# Altium project Detection_Circuit.PrjPcb
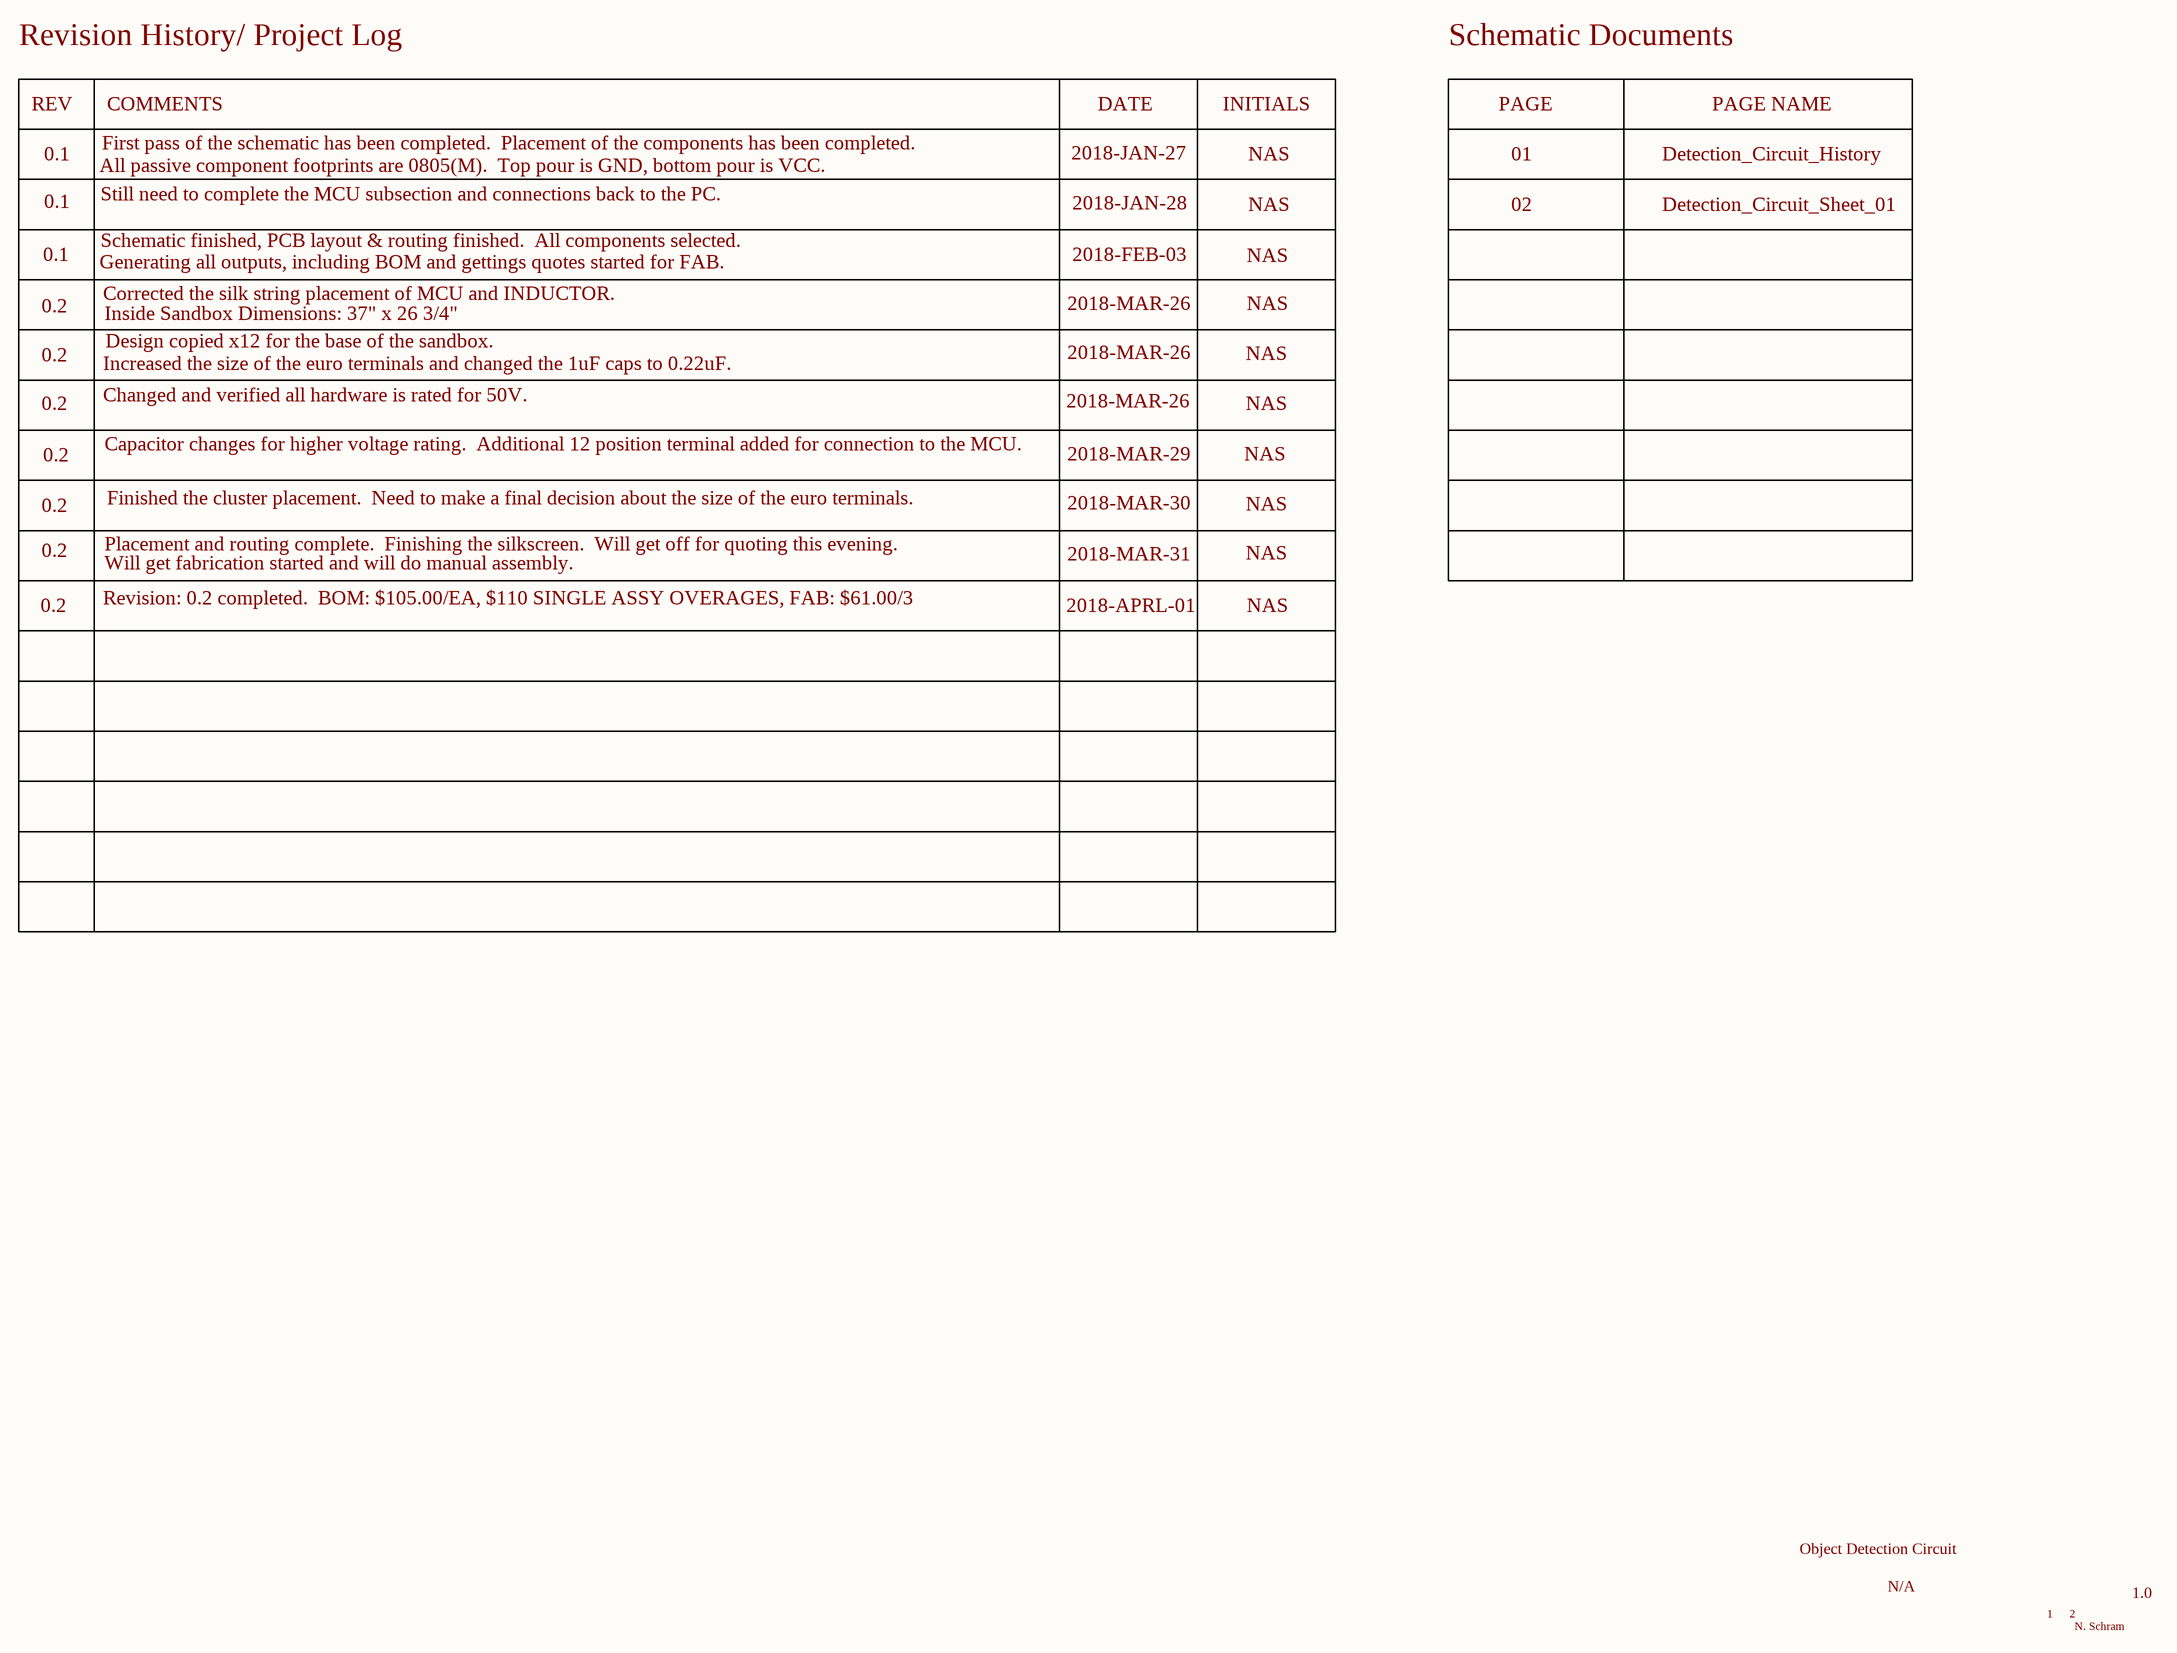
[diagram p0: Detection_Circuit_History.SchDoc]
2 sheets, 146 parts. Net scope: global (net labels, ports and power ports of the same name join across sheets).
Board file: Detection_Circuit_PCB.PcbDoc
Sheets:
  Detection_Circuit_History.SchDoc
  Detection_Circuit_Sheet_02.SchDoc

## Sheet Detection_Circuit_History.SchDoc: Object Detection PCB
size C; Date: 2018-FEB-03; Author: Nathan Schram; DrawnBy: Nathan Schram; Engineer: Nathan Schram; Revision: 1.0; SheetNumber: 1; SheetTotal: 2; DocumentName: Object Detection PCB; ProjectName: Augmented Reality Project

### Notes on the sheet
- Revision History/ Project Log
- Schematic Documents
- REV
- COMMENTS
- DATE
- INITIALS
- PAGE
- PAGE NAME
- 0.1
- All passive component footprints are 0805(M).  Top pour is GND, bottom pour is VCC.
- First pass of the schematic has been completed.  Placement of the components has been completed.
- 2018-JAN-27
- NAS
- 01
- Detection_Circuit_History
- Still need to complete the MCU subsection and connections back to the PC.
- Schematic finished, PCB layout & routing finished.  All components selected.
- 2018-JAN-28
- 02
- Detection_Circuit_Sheet_01
- 0.2
- Generating all outputs, including BOM and gettings quotes started for FAB.
- Corrected the silk string placement of MCU and INDUCTOR.
- 2018-MAR-26
- 2018-FEB-03
- Increased the size of the euro terminals and changed the 1uF caps to 0.22uF.
- Inside Sandbox Dimensions: 37" x 26 3/4"
- Design copied x12 for the base of the sandbox.
- Changed and verified all hardware is rated for 50V.
- Capacitor changes for higher voltage rating.  Additional 12 position terminal added for connection to the MCU.
- Finished the cluster placement.  Need to make a final decision about the size of the euro terminals.
- 2018-MAR-29
- Placement and routing complete.  Finishing the silkscreen.  Will get off for quoting this evening.
- 2018-MAR-30
- 2018-MAR-31
- Revision: 0.2 completed.  BOM: $105.00/EA, $110 SINGLE ASSY OVERAGES, FAB: $61.00/3
- Will get fabrication started and will do manual assembly.
- 2018-APRL-01
- Object Detection Circuit
- N/A
- 1
- 2
- N. Schram
- 1.0

## Sheet Detection_Circuit_Sheet_02.SchDoc: Object Detection
size D; Date: 2018-MAR-26; Author: N. Schram; DrawnBy: N. Schram; Engineer: N. Schram; Revision: 0.2; SheetNumber: 3
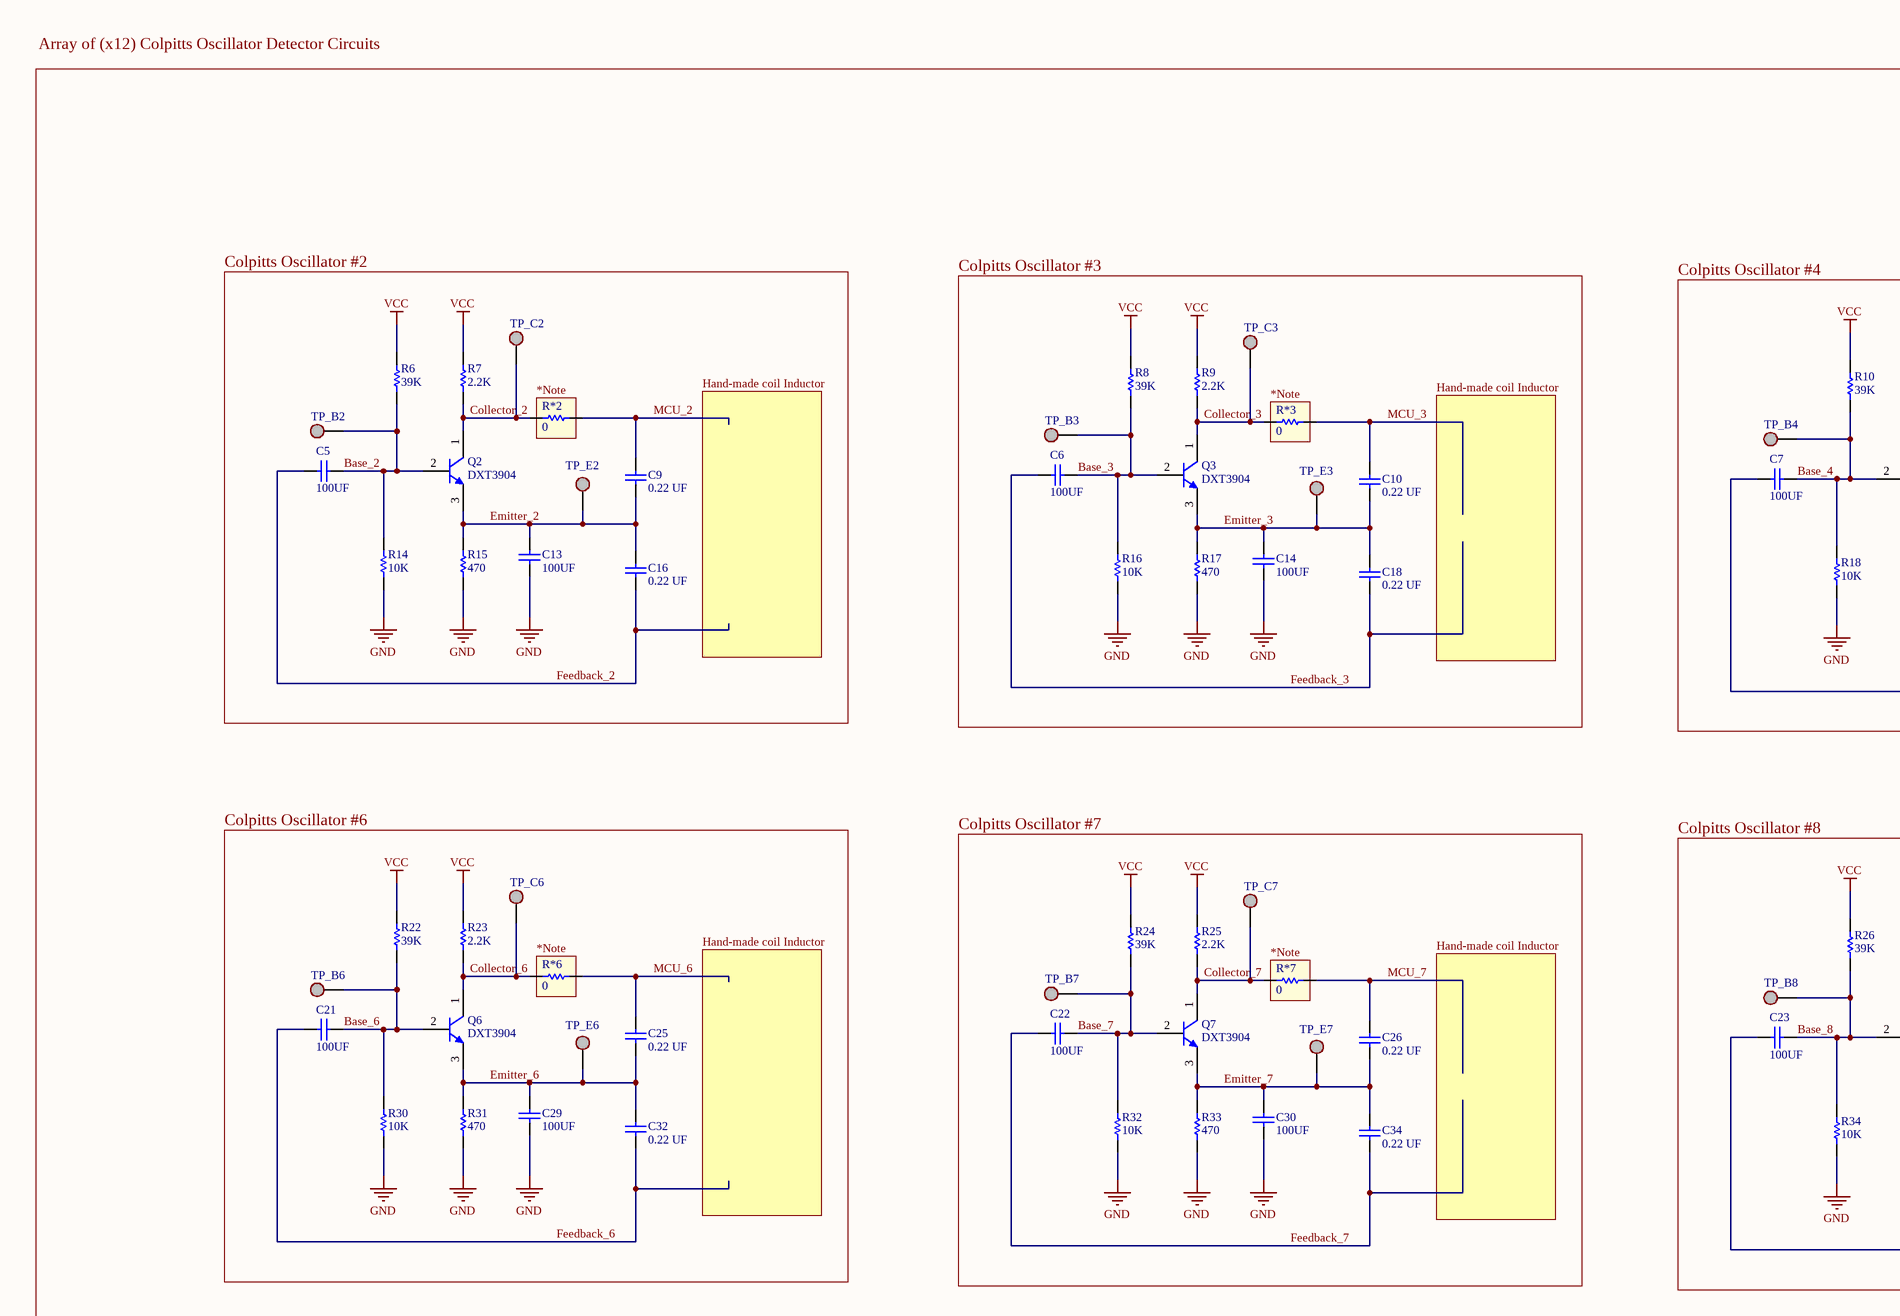
[diagram p1: Detection_Circuit_Sheet_02.SchDoc, top left]
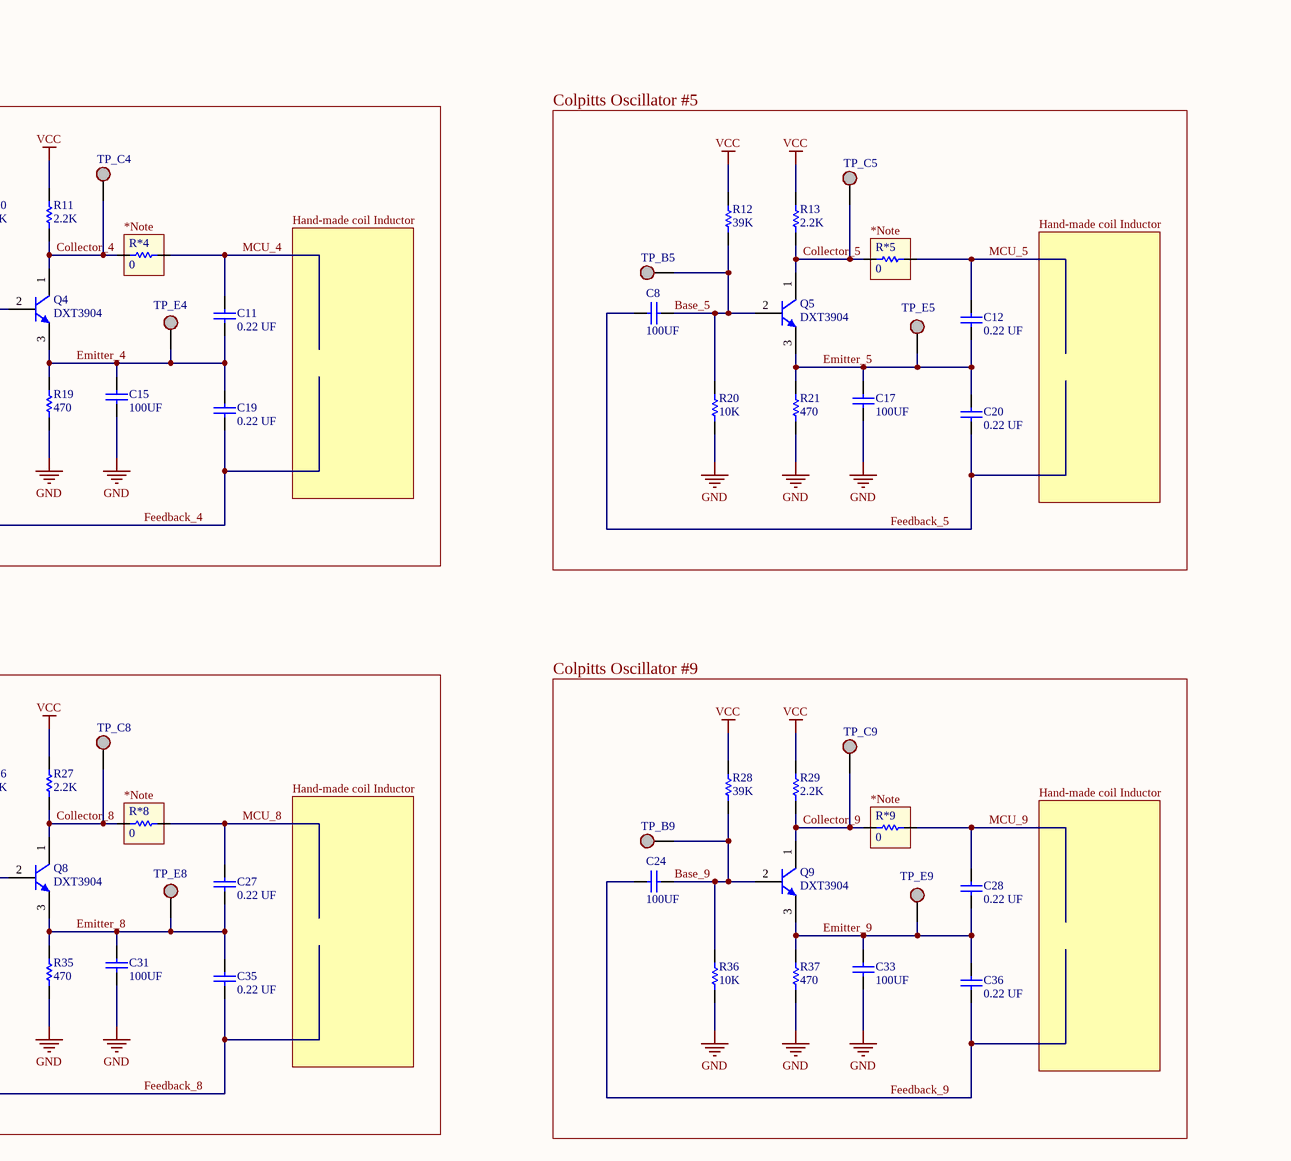
[diagram p2: Detection_Circuit_Sheet_02.SchDoc, top right]
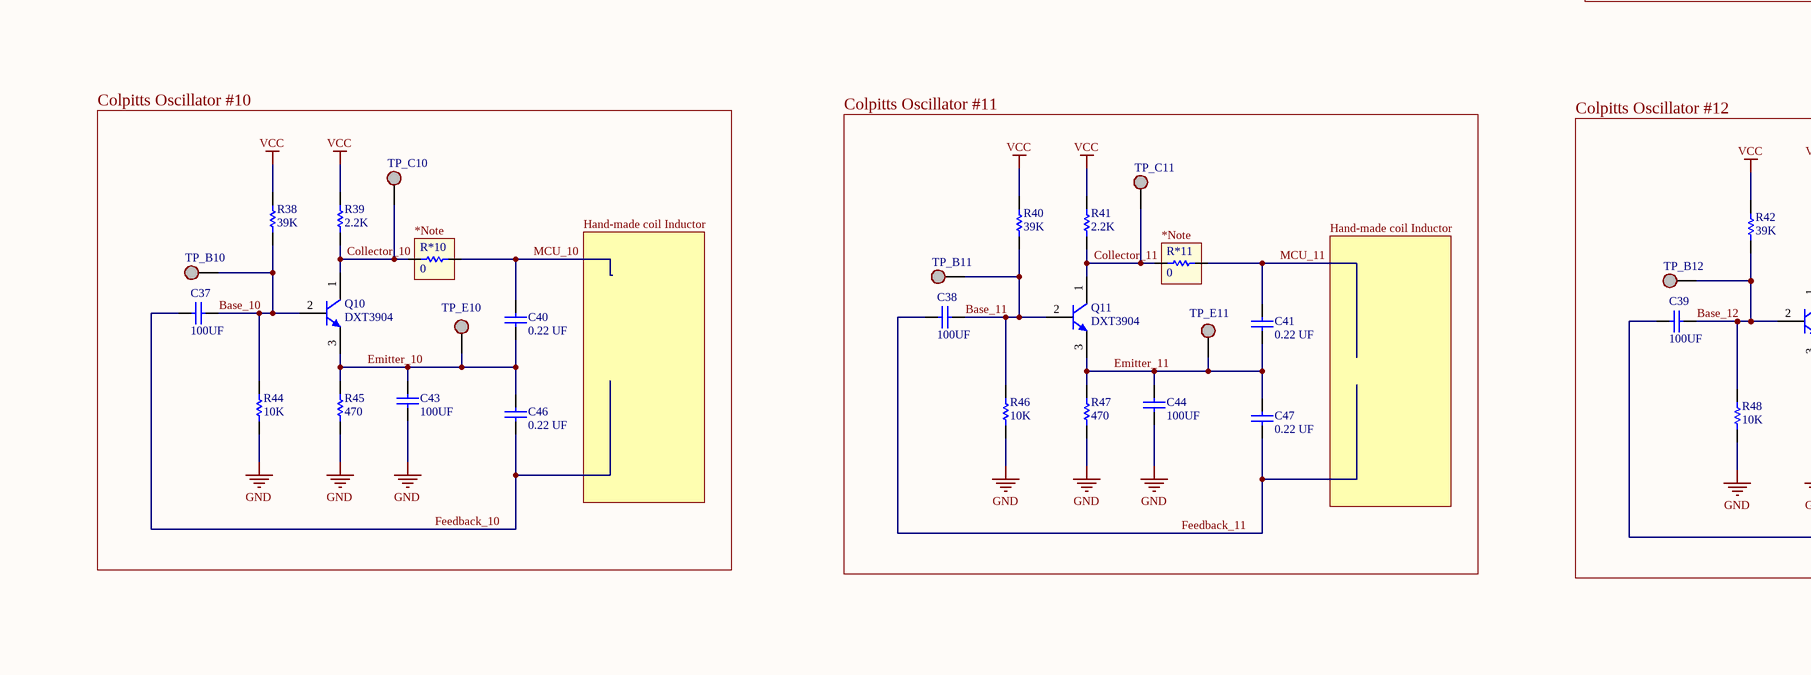
[diagram p3: Detection_Circuit_Sheet_02.SchDoc, bottom left]
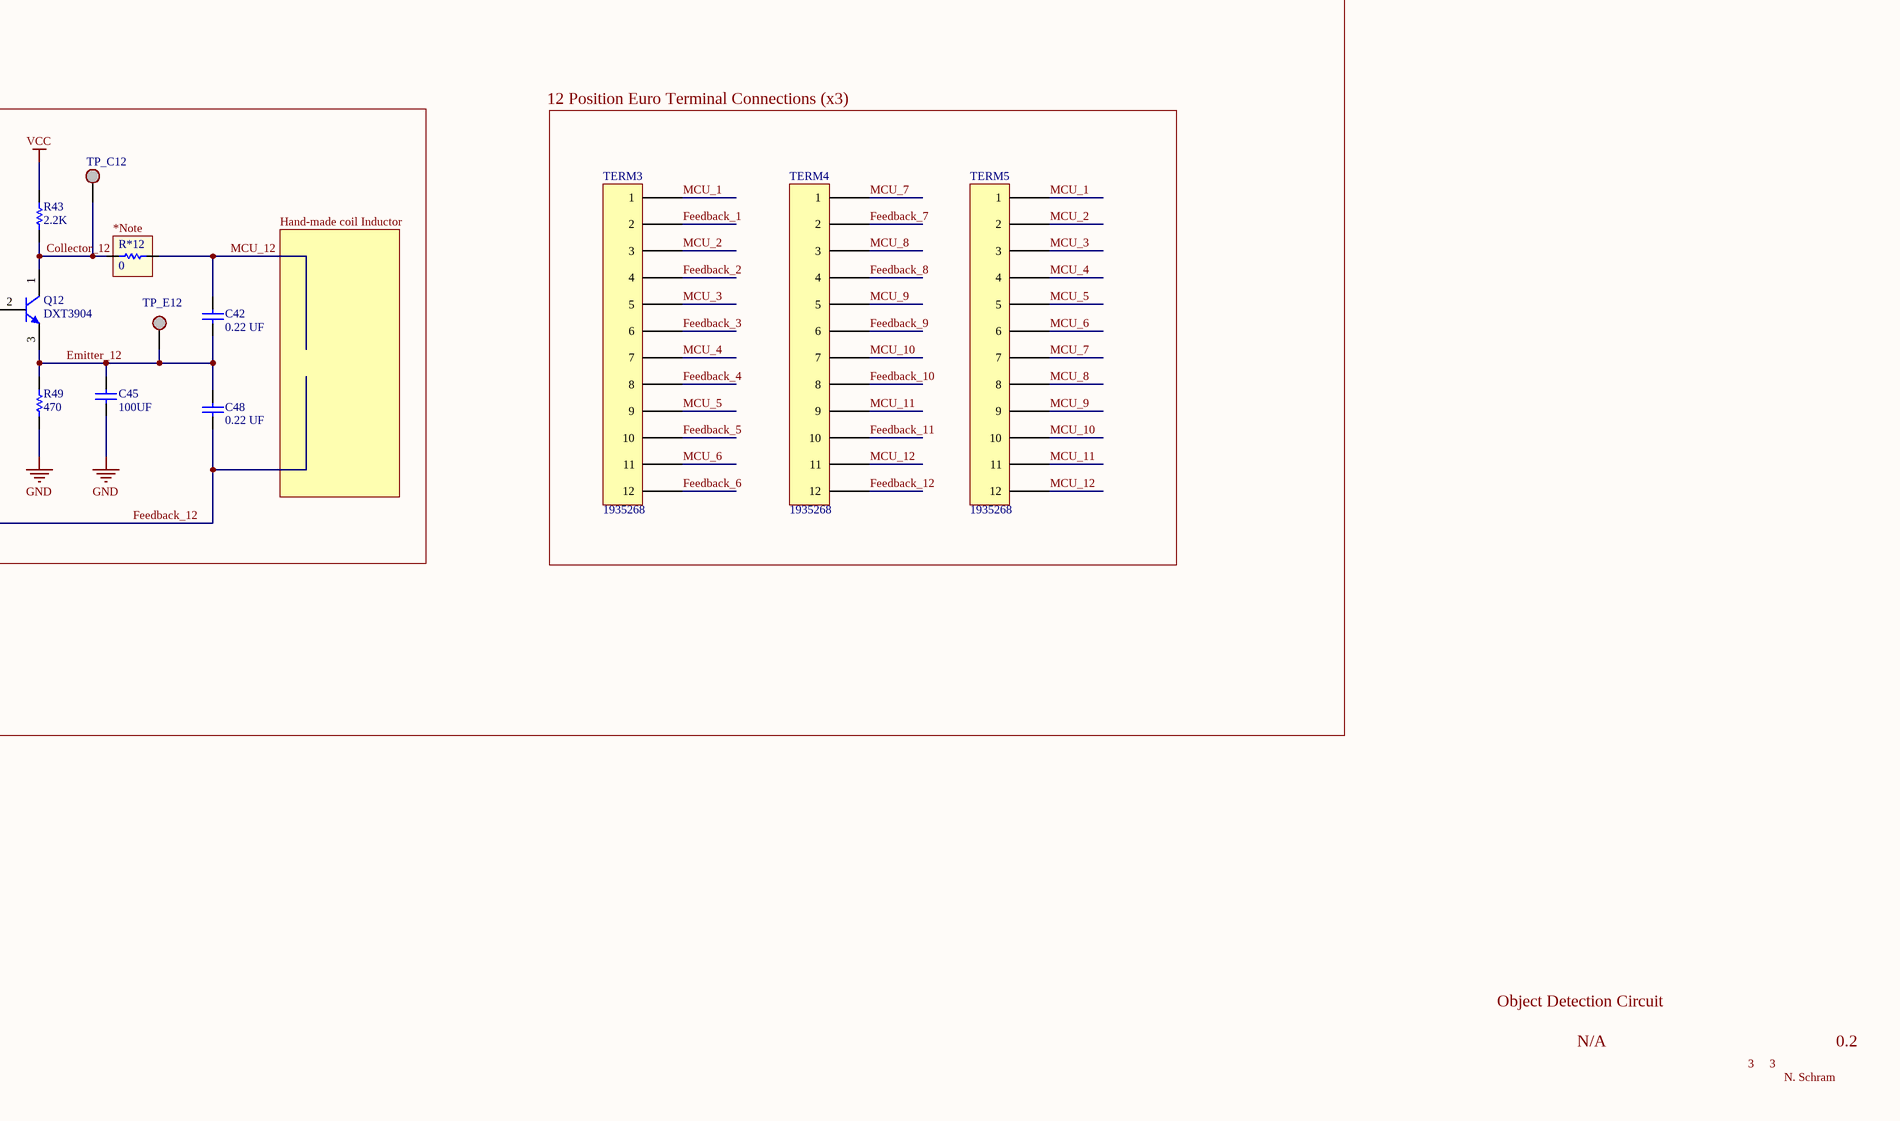
[diagram p4: Detection_Circuit_Sheet_02.SchDoc, bottom right]

### Parts
C5  100UF  [C1210_M]
C6  100UF  [C1210_M]
C7  100UF  [C1210_M]
C8  100UF  [C1210_M]
C9  Capacitance: 0.22 UF  [6-0805_N]  (hidden comment: 08055C224JAT2A)
C10  Capacitance: 0.22 UF  [6-0805_N]  (hidden comment: 08055C224JAT2A)
C11  Capacitance: 0.22 UF  [6-0805_N]  (hidden comment: 08055C224JAT2A)
C12  Capacitance: 0.22 UF  [6-0805_N]  (hidden comment: 08055C224JAT2A)
C13  100UF  [C1210_M]
C14  100UF  [C1210_M]
C15  100UF  [C1210_M]
C16  Capacitance: 0.22 UF  [6-0805_N]  (hidden comment: 08055C224JAT2A)
C17  100UF  [C1210_M]
C18  Capacitance: 0.22 UF  [6-0805_N]  (hidden comment: 08055C224JAT2A)
C19  Capacitance: 0.22 UF  [6-0805_N]  (hidden comment: 08055C224JAT2A)
C20  Capacitance: 0.22 UF  [6-0805_N]  (hidden comment: 08055C224JAT2A)
C21  100UF  [C1210_M]
C22  100UF  [C1210_M]
C23  100UF  [C1210_M]
C24  100UF  [C1210_M]
C25  Capacitance: 0.22 UF  [6-0805_N]  (hidden comment: 08055C224JAT2A)
C26  Capacitance: 0.22 UF  [6-0805_N]  (hidden comment: 08055C224JAT2A)
C27  Capacitance: 0.22 UF  [6-0805_N]  (hidden comment: 08055C224JAT2A)
C28  Capacitance: 0.22 UF  [6-0805_N]  (hidden comment: 08055C224JAT2A)
C29  100UF  [C1210_M]
C30  100UF  [C1210_M]
C31  100UF  [C1210_M]
C32  Capacitance: 0.22 UF  [6-0805_N]  (hidden comment: 08055C224JAT2A)
C33  100UF  [C1210_M]
C34  Capacitance: 0.22 UF  [6-0805_N]  (hidden comment: 08055C224JAT2A)
C35  Capacitance: 0.22 UF  [6-0805_N]  (hidden comment: 08055C224JAT2A)
C36  Capacitance: 0.22 UF  [6-0805_N]  (hidden comment: 08055C224JAT2A)
C37  100UF  [C1210_M]
C38  100UF  [C1210_M]
C39  100UF  [C1210_M]
C40  Capacitance: 0.22 UF  [6-0805_N]  (hidden comment: 08055C224JAT2A)
C41  Capacitance: 0.22 UF  [6-0805_N]  (hidden comment: 08055C224JAT2A)
C42  Capacitance: 0.22 UF  [6-0805_N]  (hidden comment: 08055C224JAT2A)
C43  100UF  [C1210_M]
C44  100UF  [C1210_M]
C45  100UF  [C1210_M]
C46  Capacitance: 0.22 UF  [6-0805_N]  (hidden comment: 08055C224JAT2A)
C47  Capacitance: 0.22 UF  [6-0805_N]  (hidden comment: 08055C224JAT2A)
C48  Capacitance: 0.22 UF  [6-0805_N]  (hidden comment: 08055C224JAT2A)
Q2  DXT3904  [DXT3904-13]
Q3  DXT3904  [DXT3904-13]
Q4  DXT3904  [DXT3904-13]
Q5  DXT3904  [DXT3904-13]
Q6  DXT3904  [DXT3904-13]
Q7  DXT3904  [DXT3904-13]
Q8  DXT3904  [DXT3904-13]
Q9  DXT3904  [DXT3904-13]
Q10  DXT3904  [DXT3904-13]
Q11  DXT3904  [DXT3904-13]
Q12  DXT3904  [DXT3904-13]
R6  39K  [6-0805_M]
R7  2.2K  [6-0805_M]
R8  39K  [6-0805_M]
R9  2.2K  [6-0805_M]
R10  39K  [6-0805_M]
R11  2.2K  [6-0805_M]
R12  39K  [6-0805_M]
R13  2.2K  [6-0805_M]
R14  10K  [6-0805_M]
R15  470  [6-0805_M]
R16  10K  [6-0805_M]
R17  470  [6-0805_M]
R18  10K  [6-0805_M]
R19  470  [6-0805_M]
R20  10K  [6-0805_M]
R21  470  [6-0805_M]
R22  39K  [6-0805_M]
R23  2.2K  [6-0805_M]
R24  39K  [6-0805_M]
R25  2.2K  [6-0805_M]
R26  39K  [6-0805_M]
R27  2.2K  [6-0805_M]
R28  39K  [6-0805_M]
R29  2.2K  [6-0805_M]
R30  10K  [6-0805_M]
R31  470  [6-0805_M]
R32  10K  [6-0805_M]
R33  470  [6-0805_M]
R34  10K  [6-0805_M]
R35  470  [6-0805_M]
R36  10K  [6-0805_M]
R37  470  [6-0805_M]
R38  39K  [6-0805_M]
R39  2.2K  [6-0805_M]
R40  39K  [6-0805_M]
R41  2.2K  [6-0805_M]
R42  39K  [6-0805_M]
R43  2.2K  [6-0805_M]
R44  10K  [6-0805_M]
R45  470  [6-0805_M]
R46  10K  [6-0805_M]
R47  470  [6-0805_M]
R48  10K  [6-0805_M]
R49  470  [6-0805_M]
R*2  0  [6-0805_M]
R*3  0  [6-0805_M]
R*4  0  [6-0805_M]
R*5  0  [6-0805_M]
R*6  0  [6-0805_M]
R*7  0  [6-0805_M]
R*8  0  [6-0805_M]
R*9  0  [6-0805_M]
R*10  0  [6-0805_M]
R*11  0  [6-0805_M]
R*12  0  [6-0805_M]
TERM3  1935268  [1935268]
TERM4  1935268  [1935268]
TERM5  1935268  [1935268]
TP_B2  TestPoint  [TestPoint]  (value not drawn)
TP_B3  TestPoint  [TestPoint]  (value not drawn)
TP_B4  TestPoint  [TestPoint]  (value not drawn)
TP_B5  TestPoint  [TestPoint]  (value not drawn)
TP_B6  TestPoint  [TestPoint]  (value not drawn)
TP_B7  TestPoint  [TestPoint]  (value not drawn)
TP_B8  TestPoint  [TestPoint]  (value not drawn)
TP_B9  TestPoint  [TestPoint]  (value not drawn)
TP_B10  TestPoint  [TestPoint]  (value not drawn)
TP_B11  TestPoint  [TestPoint]  (value not drawn)
TP_B12  TestPoint  [TestPoint]  (value not drawn)
TP_C2  TestPoint  [TestPoint]  (value not drawn)
TP_C3  TestPoint  [TestPoint]  (value not drawn)
TP_C4  TestPoint  [TestPoint]  (value not drawn)
TP_C5  TestPoint  [TestPoint]  (value not drawn)
TP_C6  TestPoint  [TestPoint]  (value not drawn)
TP_C7  TestPoint  [TestPoint]  (value not drawn)
TP_C8  TestPoint  [TestPoint]  (value not drawn)
TP_C9  TestPoint  [TestPoint]  (value not drawn)
TP_C10  TestPoint  [TestPoint]  (value not drawn)
TP_C11  TestPoint  [TestPoint]  (value not drawn)
TP_C12  TestPoint  [TestPoint]  (value not drawn)
TP_E2  TestPoint  [TestPoint]  (value not drawn)
TP_E3  TestPoint  [TestPoint]  (value not drawn)
TP_E4  TestPoint  [TestPoint]  (value not drawn)
TP_E5  TestPoint  [TestPoint]  (value not drawn)
TP_E6  TestPoint  [TestPoint]  (value not drawn)
TP_E7  TestPoint  [TestPoint]  (value not drawn)
TP_E8  TestPoint  [TestPoint]  (value not drawn)
TP_E9  TestPoint  [TestPoint]  (value not drawn)
TP_E10  TestPoint  [TestPoint]  (value not drawn)
TP_E11  TestPoint  [TestPoint]  (value not drawn)
TP_E12  TestPoint  [TestPoint]  (value not drawn)

### Blocks framed on the sheet
Colpitts Oscillator #2: C5 C9 C13 C16 Q2 R6 R7 R14 R15 R*2 TP_B2 TP_C2 TP_E2
Colpitts Oscillator #3: C6 C10 C14 C18 Q3 R8 R9 R16 R17 R*3 TP_B3 TP_C3 TP_E3
Colpitts Oscillator #4: C7 C11 C15 C19 Q4 R10 R11 R18 R19 R*4 TP_B4 TP_C4 TP_E4
Colpitts Oscillator #5: C8 C12 C17 C20 Q5 R12 R13 R20 R21 R*5 TP_B5 TP_C5 TP_E5
Colpitts Oscillator #6: C21 C25 C29 C32 Q6 R22 R23 R30 R31 R*6 TP_B6 TP_C6 TP_E6
Colpitts Oscillator #7: C22 C26 C30 C34 Q7 R24 R25 R32 R33 R*7 TP_B7 TP_C7 TP_E7
Colpitts Oscillator #8: C23 C27 C31 C35 Q8 R26 R27 R34 R35 R*8 TP_B8 TP_C8 TP_E8
Colpitts Oscillator #9: C24 C28 C33 C36 Q9 R28 R29 R36 R37 R*9 TP_B9 TP_C9 TP_E9
Colpitts Oscillator #10: C37 C40 C43 C46 Q10 R38 R39 R44 R45 R*10 TP_B10 TP_C10 TP_E10
Colpitts Oscillator #11: C38 C41 C44 C47 Q11 R40 R41 R46 R47 R*11 TP_B11 TP_C11 TP_E11
Colpitts Oscillator #12: C39 C42 C45 C48 Q12 R42 R43 R48 R49 R*12 TP_B12 TP_C12 TP_E12
12 Position Euro Terminal Connections (x3): TERM3-TERM5

### Nets
GND: C13.1 C14.1 C15.1 C17.1 C29.1 C30.1 C31.1 C33.1 C43.1 C44.1 C45.1 R14.1 R15.1 R16.1 R17.1 R18.1 R19.1 R20.1 R21.1 R30.1 R31.1 R32.1 R33.1 R34.1 R35.1 R36.1 R37.1 R44.1 R45.1 R46.1 R47.1 R48.1 R49.1
VCC: R6.2 R7.2 R8.2 R9.2 R10.2 R11.2 R12.2 R13.2 R22.2 R23.2 R24.2 R25.2 R26.2 R27.2 R28.2 R29.2 R38.2 R39.2 R40.2 R41.2 R42.2 R43.2
Base_2: C5.2 Q2.2(B) R6.1 R14.2 TP_B2.1
Base_3: C6.2 Q3.2(B) R8.1 R16.2 TP_B3.1
Base_4: C7.2 Q4.2(B) R10.1 R18.2 TP_B4.1
Base_5: C8.2 Q5.2(B) R12.1 R20.2 TP_B5.1
Base_6: C21.2 Q6.2(B) R22.1 R30.2 TP_B6.1
Base_7: C22.2 Q7.2(B) R24.1 R32.2 TP_B7.1
Base_8: C23.2 Q8.2(B) R26.1 R34.2 TP_B8.1
Base_9: C24.2 Q9.2(B) R28.1 R36.2 TP_B9.1
Base_10: C37.2 Q10.2(B) R38.1 R44.2 TP_B10.1
Base_11: C38.2 Q11.2(B) R40.1 R46.2 TP_B11.1
Base_12: C39.2 Q12.2(B) R42.1 R48.2 TP_B12.1
Collector_2: Q2.1(C) R7.1 R*2.1 TP_C2.1
Collector_3: Q3.1(C) R9.1 R*3.1 TP_C3.1
Collector_4: Q4.1(C) R11.1 R*4.1 TP_C4.1
Collector_5: Q5.1(C) R13.1 R*5.1 TP_C5.1
Collector_6: Q6.1(C) R23.1 R*6.1 TP_C6.1
Collector_7: Q7.1(C) R25.1 R*7.1 TP_C7.1
Collector_8: Q8.1(C) R27.1 R*8.1 TP_C8.1
Collector_9: Q9.1(C) R29.1 R*9.1 TP_C9.1
Collector_10: Q10.1(C) R39.1 R*10.1 TP_C10.1
Collector_11: Q11.1(C) R41.1 R*11.1 TP_C11.1
Collector_12: Q12.1(C) R43.1 R*12.1 TP_C12.1
Emitter_2: C9.1 C13.2 C16.2 Q2.3(E) R15.2 TP_E2.1
Emitter_3: C10.1 C14.2 C18.2 Q3.3(E) R17.2 TP_E3.1
Emitter_4: C11.1 C15.2 C19.2 Q4.3(E) R19.2 TP_E4.1
Emitter_5: C12.1 C17.2 C20.2 Q5.3(E) R21.2 TP_E5.1
Emitter_6: C25.1 C29.2 C32.2 Q6.3(E) R31.2 TP_E6.1
Emitter_7: C26.1 C30.2 C34.2 Q7.3(E) R33.2 TP_E7.1
Emitter_8: C27.1 C31.2 C35.2 Q8.3(E) R35.2 TP_E8.1
Emitter_9: C28.1 C33.2 C36.2 Q9.3(E) R37.2 TP_E9.1
Emitter_10: C40.1 C43.2 C46.2 Q10.3(E) R45.2 TP_E10.1
Emitter_11: C41.1 C44.2 C47.2 Q11.3(E) R47.2 TP_E11.1
Emitter_12: C42.1 C45.2 C48.2 Q12.3(E) R49.2 TP_E12.1
Feedback_1: TERM3.2
Feedback_2: C5.1 C16.1 TERM3.4
Feedback_3: C6.1 C18.1 TERM3.6
Feedback_4: C7.1 C19.1 TERM3.8
Feedback_5: C8.1 C20.1 TERM3.10
Feedback_6: C21.1 C32.1 TERM3.12
Feedback_7: C22.1 C34.1 TERM4.2
Feedback_8: C23.1 C35.1 TERM4.4
Feedback_9: C24.1 C36.1 TERM4.6
Feedback_10: C37.1 C46.1 TERM4.8
Feedback_11: C38.1 C47.1 TERM4.10
Feedback_12: C39.1 C48.1 TERM4.12
MCU_1: TERM3.1 TERM5.1
MCU_2: C9.2 R*2.2 TERM3.3 TERM5.2
MCU_3: C10.2 R*3.2 TERM3.5 TERM5.3
MCU_4: C11.2 R*4.2 TERM3.7 TERM5.4
MCU_5: C12.2 R*5.2 TERM3.9 TERM5.5
MCU_6: C25.2 R*6.2 TERM3.11 TERM5.6
MCU_7: C26.2 R*7.2 TERM4.1 TERM5.7
MCU_8: C27.2 R*8.2 TERM4.3 TERM5.8
MCU_9: C28.2 R*9.2 TERM4.5 TERM5.9
MCU_10: C40.2 R*10.2 TERM4.7 TERM5.10
MCU_11: C41.2 R*11.2 TERM4.9 TERM5.11
MCU_12: C42.2 R*12.2 TERM4.11 TERM5.12

### Notes on the sheet
- Array of (x12) Colpitts Oscillator Detector Circuits
- (near R*2) *Note
- Hand-made coil Inductor
- (near R*3) *Note
- (near R*4) *Note
- (near R*5) *Note
- (near R*6) *Note
- (near R*7) *Note
- (near R*8) *Note
- (near R*9) *Note
- (near R*10) *Note
- (near R*11) *Note
- (near R*12) *Note
- Object Detection Circuit
- N/A
- 3
- N. Schram
- 0.2

### Library data of the parts
C5-C8 C13-C15 C17 C21-C24 C29-C31 C33 C37-C39 C43-C45 = CC1210MKX5R7BB107: CAP CER 100UF 16V X5R 1210; Manufacturer: Yageo; Capacitance: 100µF; Tolerance: ±20%; Supplier 1: Digi-Key; Manufacturer Part Number: CC1210MKX5R7BB107; Family: Ceramic Capacitors; Series: CC; Packaging: Tape & Reel (TR); Voltage - Rated: 16V; Temperature Coefficient: X5R; Mounting Type: Surface Mount, MLCC; Operating Temperature: -55°C ~ 85°C; Applications: General Purpose; Ratings: -; Package / Case: 1210 (3225 Metric); Size / Dimension: 0.126" L x 0.098" W (3.20mm x 2.50mm); Height - Seated (Max): -; Thickness (Max): 0.110" (2.80mm); Lead Spacing: -; Features: -; Lead Style: -; ComponentLink1URL: http://www.mouser.com/ds/2/447/Yageo_UPY-GP_NP0_16V-to-50V_9-358835.pdf; ComponentLink1Description: http://www.mouser.com/ds/2/447/Yageo_UPY-GP_NP0_16V-to-50V_9-358835.pdf; ComponentLink2URL: http://www.yageo.com/documents/recent/UPY-GPHC_X5R_4V-to-50V_25.pdf; ComponentLink2Description: http://www.yageo.com/documents/recent/UPY-GPHC_X5R_4V-to-50V_25.pdf; Supplier Part Number 1: 311-2052-1-ND; Stock 1: 19901; Pricing 1: 1=1.82, 10=1.437, 100=1.0778 (USD); Category: Capacitors
C9-C12 C16 C18-C20 C25-C28 C32 C34-C36 C40-C42 C46-C48 = 08055C224JAT2A: CAP CER 0.22UF 50V X7R 0805; Manufacturer: AVX Corporation; Tolerance: ±5%; Notification: Current market demand for these product types have resulted in fluctuating and extending lead times. Lead times may differ.; Supplier 1: Digi-Key; Manufacturer Part Number: 08055C224JAT2A; RoHS: RoHS Compliant; Category: Capacitors; Stock 1: 25172; Pricing 1: 1=0.55, 10=0.387, 100=0.255, 500=0.18886, 1000=0.16053 (USD); Packaging: Cut Tape (CT); Part Status: Active; Voltage - Rated: 50V; Temperature Coefficient: X7R; Operating Temperature: -55°C ~ 125°C; Features: -; Ratings: -; Applications: General Purpose; Mounting Type: Surface Mount, MLCC; Package / Case: 0805 (2012 Metric); Size / Dimension: 0.079" L x 0.049" W (2.00mm x 1.25mm); Height - Seated (Max): -; Thickness (Max): 0.037" (0.94mm); Lead Spacing: -; Lead Style: -; ComponentLink1URL: http://datasheets.avx.com/X7RDielectric.pdf; ComponentLink1Description: http://datasheets.avx.com/X7RDielectric.pdf; Supplier Part Number 1: 478-7437-1-ND
Q2-Q12 = DXT3904-13: TRANS NPN 40V 0.2A SOT89-3; Manufacturer: Diodes; Configuration: Single; Collector- Base Voltage VCBO: 60 V; Emitter- Base Voltage VEBO: 6 V; Collector-Emitter Saturation Voltage: 300 mV; Maximum DC Collector Current: 200 mA; Gain Bandwidth Product fT: 300 MHz; Brand: Diodes Incorporated; DC Collector/Base Gain hfe Min: 30 at 100 mA, 1 V; Pd - Power Dissipation: 1000 mW; Unit Weight: 0.001834 oz; Supplier 1: Digi-Key; Manufacturer Part Number: DXT3904-13; Product Category: Bipolar Transistors - BJT; Mounting Style: SMD/SMT; Package / Case: SOT-89; Transistor Polarity: NPN; Collector- Emitter Voltage VCEO Max: 40 V; Maximum Operating Temperature: + 150 C; Series: DXT3904; Height: 1.5 mm; Length: 4.5 mm; Minimum Operating Temperature: - 55 C; Packaging: Reel; Factory Pack Quantity: 2500; Width: 2.48 mm; ComponentLink1URL: https://datasheet.ciiva.com/979/ds31141-979988.pdf; ComponentLink1Description: https://datasheet.ciiva.com/979/ds31141-979988.pdf; ComponentLink2URL: https://datasheet.ciiva.com/4724/ds31141-4724919.pdf; ComponentLink2Description: https://datasheet.ciiva.com/4724/ds31141-4724919.pdf; ComponentLink3URL: https://datasheet.ciiva.com/17303/ds31141-17303788.pdf; ComponentLink3Description: https://datasheet.ciiva.com/17303/ds31141-17303788.pdf; ComponentLink4URL: https://datasheet.ciiva.com/11206/ds31141-11206239.pdf; ComponentLink4Description: https://datasheet.ciiva.com/11206/ds31141-11206239.pdf; Supplier Part Number 1: DXT3904-13DICT-ND; Stock 1: 10942; Pricing 1: 1=0.53, 10=0.426, 100=0.29, 500=0.2175, 1000=0.1632 (USD); RoHS: True
R6 R8 R10 R12 R22 R24 R26 R28 R38 R40 R42 = ERJ-PB6D3902V: RES SMD 39K OHM 0.5% 1/4W 0805; Manufacturer: Panasonic; Power (Watts): 0.25W, 1/4W; Temperature Coefficient: ±50ppm/°C; Supplier 1: Digi-Key; Manufacturer Part Number: ERJ-PB6D3902V; Family: Chip Resistor - Surface Mount; Series: ERJ; Packaging: Tape & Reel (TR); Part Status: Active; Resistance (Ohms): 39k; Tolerance: ±0.5%; Composition: Thick Film; Features: Automotive AEC-Q200, Pulse Withstanding; Operating Temperature: -55°C ~ 155°C; Package / Case: 0805 (2012 Metric); Supplier Device Package: 0805; Size / Dimension: 0.079" L x 0.049" W (2.00mm x 1.25mm); Height - Seated (Max): 0.028" (0.70mm); Number of Terminations: 2; Failure Rate: -; ComponentLink1URL: https://industrial.panasonic.com/sa/system/files/data/download/catalog/id_fixed-resistors_e_2.pdf; ComponentLink1Description: https://industrial.panasonic.com/sa/system/files/data/download/catalog/id_fixed-resistors_e_2.pdf; Supplier Part Number 1: P21199CT-ND; Stock 1: 2236; Pricing 1: 1=0.24, 10=0.204, 25=0.1488, 50=0.1078, 100=0.0799, 250=0.0614, 500=0.0483, 1000=0.0335 (USD); Category: Resistors
R7 R9 R11 R13 R23 R25 R27 R29 R39 R41 R43 = ERJ-PB6D2201V: RES SMD 2.2K OHM 0.5% 1/4W 0805; Manufacturer: Panasonic; Power (Watts): 0.25W, 1/4W; Temperature Coefficient: ±50ppm/°C; Supplier 1: Digi-Key; Manufacturer Part Number: ERJ-PB6D2201V; Family: Chip Resistor - Surface Mount; Series: ERJ; Packaging: Tape & Reel (TR); Part Status: Active; Resistance (Ohms): 2.2k; Tolerance: ±0.5%; Composition: Thick Film; Features: Automotive AEC-Q200, Pulse Withstanding; Operating Temperature: -55°C ~ 155°C; Package / Case: 0805 (2012 Metric); Supplier Device Package: 0805; Size / Dimension: 0.079" L x 0.049" W (2.00mm x 1.25mm); Height - Seated (Max): 0.028" (0.70mm); Number of Terminations: 2; Failure Rate: -; ComponentLink1URL: https://industrial.panasonic.com/sa/system/files/data/download/catalog/id_fixed-resistors_e_2.pdf; ComponentLink1Description: https://industrial.panasonic.com/sa/system/files/data/download/catalog/id_fixed-resistors_e_2.pdf; Supplier Part Number 1: P21055CT-ND; Stock 1: 3147; Pricing 1: 1=0.24, 10=0.204, 25=0.1488, 50=0.1078, 100=0.0799, 250=0.0614, 500=0.0483, 1000=0.0335 (USD); Category: Resistors
R14 R16 R18 R20 R30 R32 R34 R36 R44 R46 R48 = RNCP0805FTD10K0: RES SMD 10K OHM 1% 1/4W 0805; Manufacturer: Stackpole Electronics; Power (Watts): 0.25W, 1/4W; Temperature Coefficient: ±100ppm/°C; Supplier 1: Digi-Key; Manufacturer Part Number: RNCP0805FTD10K0; Family: Chip Resistor - Surface Mount; Series: RNCP; Packaging: Tape & Reel (TR); Resistance (Ohms): 10k; Tolerance: ±1%; Composition: Thin Film; Features: Anti-Sulfur, Moisture Resistant; Operating Temperature: -55°C ~ 155°C; Package / Case: 0805 (2012 Metric); Supplier Device Package: 0805; Size / Dimension: 0.079" L x 0.049" W (2.00mm x 1.25mm); Height: 0.024" (0.60mm); Number of Terminations: 2; ComponentLink1URL: http://www.seielect.com/Catalog/SEI-rncp.pdf; ComponentLink1Description: http://www.seielect.com/Catalog/SEI-rncp.pdf; Supplier Part Number 1: RNCP0805FTD10K0CT-ND; Stock 1: 103823; Pricing 1: 1=0.1, 10=0.037, 100=0.015, 1000=0.0067, 2500=0.0058 (USD); Category: Resistors
R15 R17 R19 R21 R31 R33 R35 R37 R45 R47 R49 = ERJ-PB6D4700V: RES SMD 470 OHM 0.5% 1/4W 0805; Manufacturer: Panasonic; Power (Watts): 0.25W, 1/4W; Temperature Coefficient: ±50ppm/°C; Supplier 1: Digi-Key; Manufacturer Part Number: ERJ-PB6D4700V; Family: Chip Resistor - Surface Mount; Series: ERJ; Packaging: Cut Tape (CT); Part Status: Active; Resistance (Ohms): 470; Tolerance: ±0.5%; Composition: Thick Film; Features: Automotive AEC-Q200, Pulse Withstanding; Operating Temperature: -55°C ~ 155°C; Package / Case: 0805 (2012 Metric); Supplier Device Package: 0805; Size / Dimension: 0.079" L x 0.049" W (2.00mm x 1.25mm); Height - Seated (Max): 0.028" (0.70mm); Number of Terminations: 2; Failure Rate: -; ComponentLink1URL: https://industrial.panasonic.com/sa/system/files/data/download/catalog/id_fixed-resistors_e_2.pdf; ComponentLink1Description: https://industrial.panasonic.com/sa/system/files/data/download/catalog/id_fixed-resistors_e_2.pdf; Supplier Part Number 1: P20981CT-ND; Stock 1: 2688; Pricing 1: 1=0.24, 10=0.204, 25=0.1488, 50=0.1078, 100=0.0799, 250=0.0614, 500=0.0483, 1000=0.0335 (USD); Category: Resistors
R*2-R*12 = ERJ-6GEY0R00V: RES SMD 0 OHM JUMPER 1/8W 0805; Manufacturer: Panasonic ECG; Rated Power: 0.125 W; Resistance: 0 O; Tolerance (%): 0 %; Temp Coefficient: 0 ppm/°C; Supplier 1: Digi-Key; Manufacturer Part Number: ERJ-6GEY0R00V; Size Code: 0805; ComponentLink1URL: https://datasheet.ciiva.com/28695/1678796-28695877.pdf; ComponentLink1Description: https://datasheet.ciiva.com/28695/1678796-28695877.pdf; ComponentLink2URL: https://datasheet.ciiva.com/11821/0900766b80f806dd-11821735.pdf; ComponentLink2Description: https://datasheet.ciiva.com/11821/0900766b80f806dd-11821735.pdf; ComponentLink3URL: https://datasheet.ciiva.com/43460/1678796-43460073.pdf; ComponentLink3Description: https://datasheet.ciiva.com/43460/1678796-43460073.pdf; ComponentLink4URL: https://datasheet.ciiva.com/9117/aoa0000ce1-9117354.pdf; ComponentLink4Description: https://datasheet.ciiva.com/9117/aoa0000ce1-9117354.pdf; ComponentLink5URL: https://datasheet.ciiva.com/46377/1678796-46377866.pdf; ComponentLink5Description: https://datasheet.ciiva.com/46377/1678796-46377866.pdf; ComponentLink6URL: https://datasheet.ciiva.com/36526/1989607-36526237.pdf; ComponentLink6Description: https://datasheet.ciiva.com/36526/1989607-36526237.pdf; ComponentLink7URL: https://datasheet.ciiva.com/17215/aoa0000ce1-17215390.pdf; ComponentLink7Description: https://datasheet.ciiva.com/17215/aoa0000ce1-17215390.pdf; ComponentLink8URL: https://datasheet.ciiva.com/16512/aoa0000ce1-16512111.pdf; ComponentLink8Description: https://datasheet.ciiva.com/16512/aoa0000ce1-16512111.pdf; Supplier Part Number 1: P0.0ACT-ND; Stock 1: 6840904; Pricing 1: 1=0.1, 10=0.053, 25=0.038, 50=0.029, 100=0.0214, 250=0.0163, 500=0.0131, 1000=0.0096 (USD)
TERM3-TERM5 = 1935268: TERM BLOCK PCB 12POS 5.0MM GREEN; Manufacturer: Phoenix Contact; Positions Per Level: 12; Pitch: 0.197" (5.00mm); Mating Orientation: Horizontal with Board; Wire Gauge: 12-26 AWG; Wire Termination: Screw; Torque - Screw: 0.35-0.4 Nm (3.1-3.5 Lb-In); Screw Thread: M2.6; Supplier 1: Digi-Key; Manufacturer Part Number: 1935268; RoHS: RoHS Compliant; Category: Connectors, Interconnects; Stock 1: 4448; Pricing 1: 1=2.2, 10=2.14, 50=2, 100=1.84, 250=1.7 (USD); Packaging: Bulk; Part Status: Active; Mounting Type: Through Hole; Features: Interlocking (Side); Color: Green; Operating Temperature: -; Housing Material: Polyamide (PA), Nylon; Contact Material - Plating: -; Clamp Material - Plating: -; Screw Material - Plating: -; ComponentLink1URL: https://media.digikey.com/pdf/Data%20Sheets/Phoenix%20Contact%20PDFs/1935268.pdf; ComponentLink1Description: https://media.digikey.com/pdf/Data%20Sheets/Phoenix%20Contact%20PDFs/1935268.pdf; Supplier Part Number 1: 277-1587-ND
TP_B2-TP_B12 TP_C2-TP_C12 TP_E2-TP_E12 = TestPoint: Test Point